# EAGLE schematic EMGtestfinal (EAGLE 9.3.1)
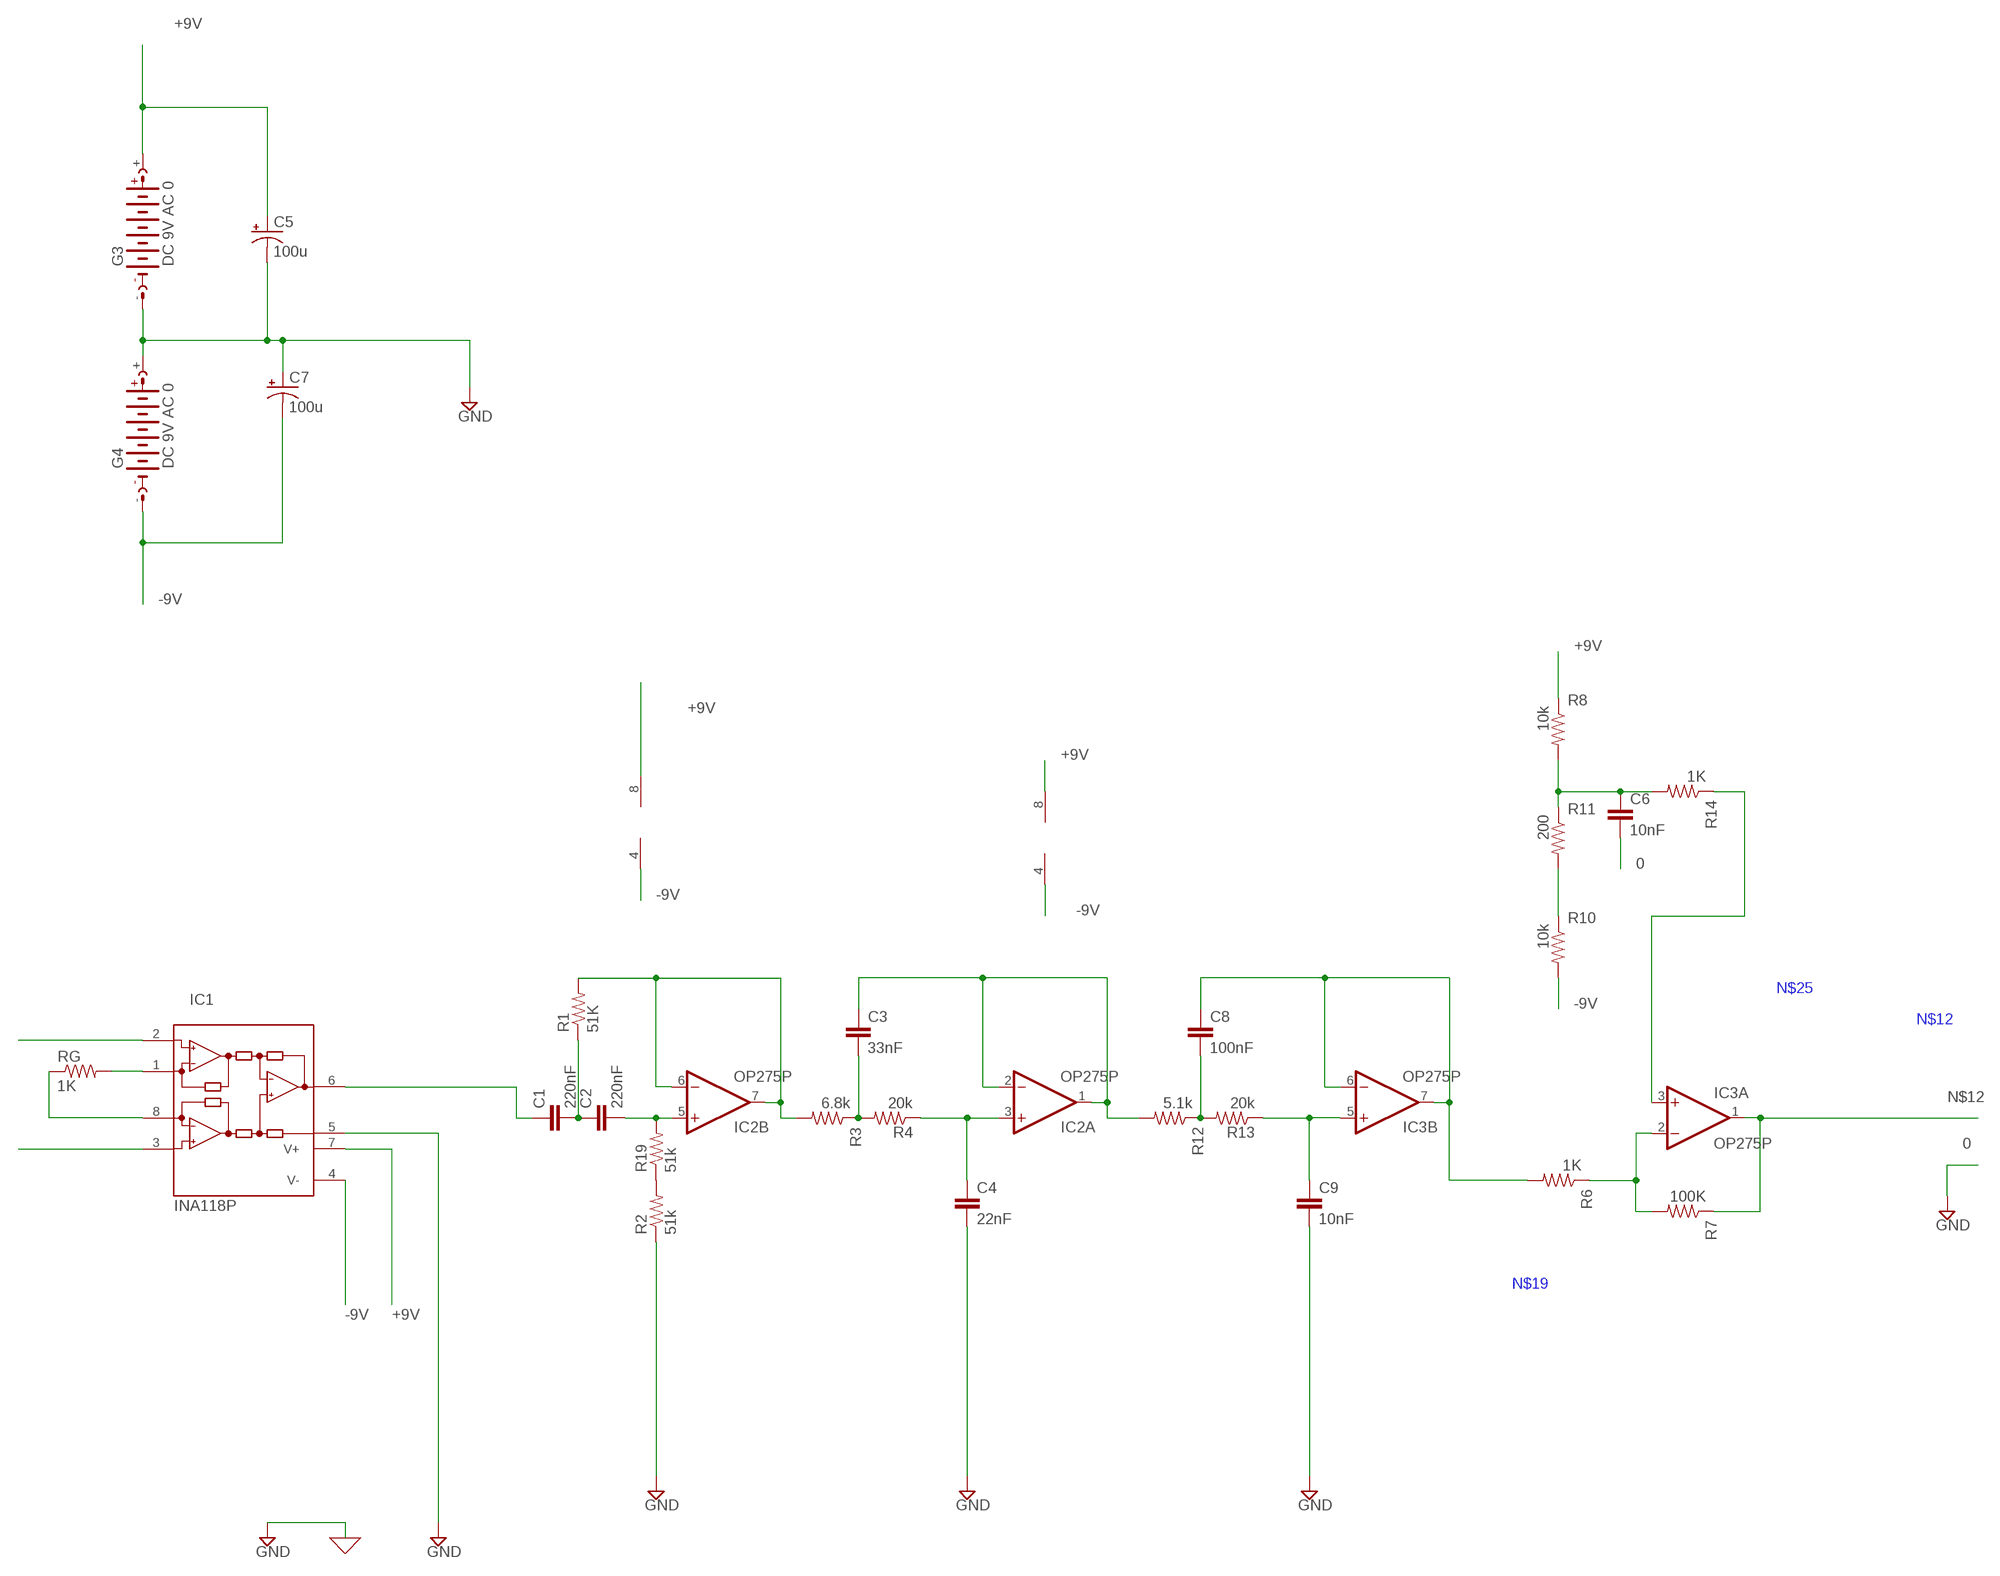
[diagram p0: schematic, sheet 1]

## Parts
C1  220nF  C-EU050-035X075  [C050-035X075]
C2  220nF  C-EU050-035X075  [C050-035X075]
C3  33nF  C-EU050-035X075  [C050-035X075]
C4  22nF  C-EU050-035X075  [C050-035X075]
C5  100u  CPOL-USE2.5-6  [E2,5-6]
C6  10nF  C-EU050-035X075  [C050-035X075]
C7  100u  CPOL-USE2.5-6  [E2,5-6]
C8  100nF  C-EU050-035X075  [C050-035X075]
C9  10nF  C-EU050-035X075  [C050-035X075]
G3  DC 9V AC 0  AB9V  [AB9V]
G4  DC 9V AC 0  AB9V  [AB9V]
IC1  INA118P  [DIL08]
IC2  OP275P  [DIL08]
IC3  OP275P  [DIL08]
R1  51K  R-US_0207/7  [0207/7]
R2  51k  R-US_0207/7  [0207/7]
R3  6.8k  R-US_0207/7  [0207/7]
R4  20k  R-US_0207/7  [0207/7]
R6  1K  R-US_0207/7  [0207/7]
R7  100K  R-US_0207/7  [0207/7]
R8  10k  R-US_0207/7  [0207/7]
R10  10k  R-US_0207/7  [0207/7]
R11  200  R-US_0207/7  [0207/7]
R12  5.1k  R-US_0207/7  [0207/7]
R13  20k  R-US_0207/7  [0207/7]
R14  1K  R-US_0207/7  [0207/7]
R19  51k  R-US_0207/7  [0207/7]
RG  1K  R-US_0207/7  [0207/7]

## Nets
0: C4.2 C5.- C6.2 C7.+ C9.2 G3.- G4.+ IC1.5(REF) R2.1 ; supply symbol labelled GND
+9V: C5.+ G3.+ IC1.7(V+) IC2.8(P:V+) IC3.8(P:V+) R8.1
-9V: C7.- G4.- IC1.4(V-) IC2.4(P:V-) IC3.4(P:V-) R10.2
N$1: IC1.1(RG) RG.2
N$2: IC1.8(RG) RG.1
N$3: IC1.2(-IN)
N$4: C8.2 R12.1 R13.2
N$5: C1.2 C2.1 R1.1
N$6: C1.1 IC1.6(OUT)
N$7: C2.2 IC2.5(B:+IN) R19.2
N$8: IC2.6(B:-IN) IC2.7(B:OUT) R1.2 R3.2
N$9: C3.2 R3.1 R4.2
N$10: C4.1 IC2.3(A:+IN) R4.1
N$11: C3.1 IC2.1(A:OUT) IC2.2(A:-IN) R12.2
N$12: IC3.1(A:OUT) R7.1
N$14: C9.1 IC3.5(B:+IN) R13.1
N$15: R10.1 R11.2
N$17: IC3.2(A:-IN) R6.1 R7.2
N$19: C8.1 IC3.6(B:-IN) IC3.7(B:OUT) R6.2
N$20: C6.1 R8.2 R11.1 R14.2
N$23: R2.2 R19.1
N$25: IC3.3(A:+IN) R14.1
N$26: IC1.3(+IN)

## Library data of the parts
C1-C4 C6 C8 C9 = rcl:C-EU: CAPACITOR, European symbol; SPICEPREFIX: C
C5 C7 = rcl:CPOL-US: POLARIZED CAPACITOR, American symbol; SPICEPREFIX: C
G3 G4 = battery:AB9V: 9-V BATTERY CLIP; SPICEPREFIX: V
IC1 = burr-brown:INA118: Instrumentation Amplifier Precision, Low Power; MF: TEXAS INSTRUMENTS; MPN: INA118P; OC_FARNELL: 1470354; OC_NEWARK: 96K4515; SPICEMODEL: INA118a; SPICEPREFIX: X
IC2 IC3 = linear:OP275: Dual Very Low Noise Precision Operational Amplifier Source: http://www.analog.com/static/imported-files/data_sheets/OP270.pdf; SPICEMODEL: OP275p; SPICEPREFIX: X
R1-R4 R6-R8 R10-R14 R19 RG = rcl:R-US_: RESISTOR, American symbol; SPICEPREFIX: R

## Module MO
Ports: OUT(io) IN(io)

### Library data of the parts